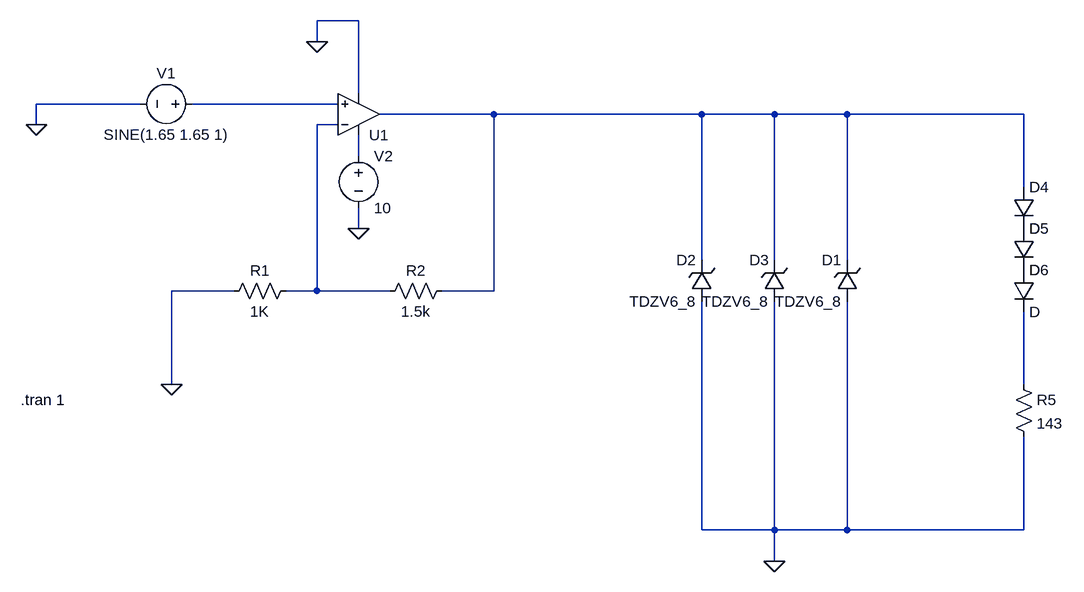
[diagram p0: schematic 4_20mA_Circuit.asc]
4_20mA_Circuit.asc, the LTspice schematic file:
Version 4
SHEET 1 2160 856
WIRE 208 -96 144 -96
WIRE 144 -64 144 -96
WIRE 208 16 208 -96
WIRE -128 32 -288 32
WIRE 176 32 -48 32
WIRE 416 48 240 48
WIRE 736 48 416 48
WIRE 848 48 736 48
WIRE 960 48 848 48
WIRE 1232 48 960 48
WIRE -288 64 -288 32
WIRE 176 64 144 64
WIRE 208 112 208 80
WIRE 1232 160 1232 48
WIRE 208 224 208 192
WIRE 736 272 736 48
WIRE 848 272 848 48
WIRE 960 272 960 48
WIRE 16 320 -80 320
WIRE 144 320 144 64
WIRE 144 320 96 320
WIRE 256 320 144 320
WIRE 416 320 416 48
WIRE 416 320 336 320
WIRE -80 464 -80 320
WIRE 1232 464 1232 352
WIRE 736 688 736 336
WIRE 848 688 848 336
WIRE 848 688 736 688
WIRE 960 688 960 336
WIRE 960 688 848 688
WIRE 1232 688 1232 544
WIRE 1232 688 960 688
WIRE 848 736 848 688
FLAG -80 464 0
FLAG -288 64 0
FLAG 144 -64 0
FLAG 208 224 0
FLAG 848 736 0
SYMBOL voltage -32 32 R90
WINDOW 0 -32 56 VBottom 2
WINDOW 3 32 56 VTop 2
WINDOW 123 0 0 Left 0
WINDOW 39 0 0 Left 0
SYMATTR InstName V1
SYMATTR Value SINE(1.65 1.65 1)
SYMBOL OpAmps\\UniversalOpAmp 208 48 M180
SYMATTR InstName U1
SYMBOL res 112 304 R90
WINDOW 0 0 56 VBottom 2
WINDOW 3 32 56 VTop 2
SYMATTR InstName R1
SYMATTR Value 1K
SYMBOL res 352 304 R90
WINDOW 0 0 56 VBottom 2
WINDOW 3 32 56 VTop 2
SYMATTR InstName R2
SYMATTR Value 1.5k
SYMBOL voltage 208 96 R0
WINDOW 123 0 0 Left 0
WINDOW 39 0 0 Left 0
SYMATTR InstName V2
SYMATTR Value 10
SYMBOL zener 976 336 R180
WINDOW 0 24 64 Left 2
WINDOW 3 24 0 Left 2
SYMATTR InstName D1
SYMATTR Value TDZV6_8
SYMBOL zener 752 336 R180
WINDOW 0 24 64 Left 2
WINDOW 3 24 0 Left 2
SYMATTR InstName D2
SYMATTR Value TDZV6_8
SYMBOL zener 864 336 R180
WINDOW 0 24 64 Left 2
WINDOW 3 24 0 Left 2
SYMATTR InstName D3
SYMATTR Value TDZV6_8
SYMBOL res 1216 448 R0
SYMATTR InstName R5
SYMATTR Value 143
SYMBOL diode 1216 160 R0
SYMATTR InstName D4
SYMBOL diode 1216 224 R0
SYMATTR InstName D5
SYMBOL diode 1216 288 R0
SYMATTR InstName D6
TEXT -312 488 Left 2 !.tran 1

The netlist it stands for:
* 4_20mA_Circuit.asc
V1 N001 0 SINE(1.65 1.65 1)
XU1 N001 N003 N004 0 N002 level1 Avol=1Meg GBW=10Meg Vos=0 En=0 Enk=0 In=0 Ink=0 Rin=500Meg  ; pins In+ In- V+ V- OUT
R1 N003 0 1K
R2 N002 N003 1.5k
V2 N004 0 10
D1 0 N002 TDZV6_8
D2 0 N002 TDZV6_8
D3 0 N002 TDZV6_8
R5 N005 0 143
D4 N002 P001 D
D5 P001 P002 D
D6 P002 N005 D
.model D D
.lib standard.dio
.tran 1
.lib UniversalOpAmp1.lib
.backanno
.end